# Altium schematic sheet PowerStage.SchDoc: Controlador PID
size A4; Organization: Altium Limited; Address1: L3, 12a Rodborough Rd; Address2: Frenchs Forest; Address3: NSW; Address4: Australia 2086; Revision: R01; sheetnumberh: 3; sheettotall: 5; Alumno: Irumberry Juan - Matwiejczuk Leandro; Curso: 512; Materia: Técnicas Digitales III; Docentes: Ing. Marín Ariel; SheetNumber: 3; SheetTotal: 5
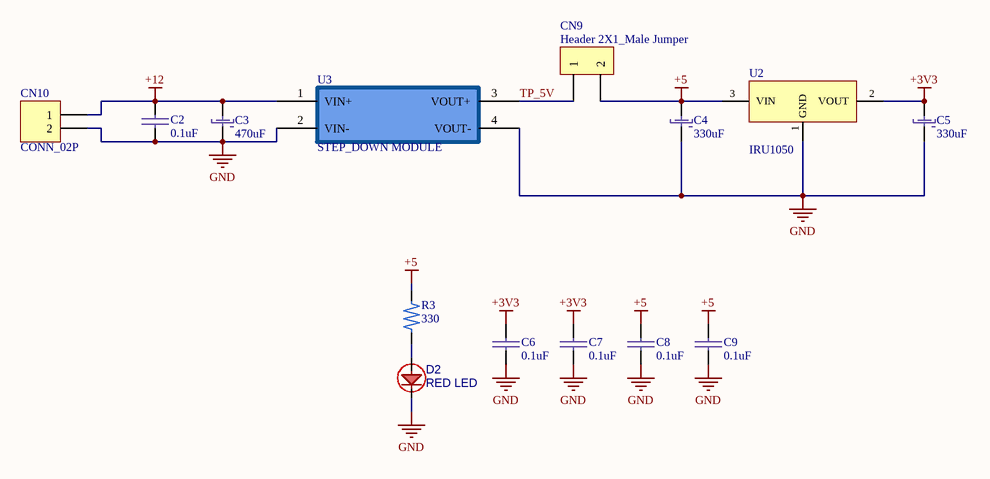
[diagram p0: PowerStage.SchDoc]

## Parts
C2  0.1uF  [CAP_Axial_0.2mm]
C3  470uF  [C_RAD_11MM]
C4  330uF  [C_RAD_5mm]
C5  330uF  [C_RAD_5mm]
C6  0.1uF  [CAP_Axial_0.2mm]
C7  0.1uF  [CAP_Axial_0.2mm]
C8  0.1uF  [CAP_Axial_0.2mm]
C9  0.1uF  [CAP_Axial_0.2mm]
CN9  Header 2X1_Male Jumper  [JUMPER 2x1 PIN]
CN10  CONN_02P  [TERMINAL_BLOCK_2_PIN]
D2  RED LED  [LED_DIODE_3.9mm]
R3  330  [RES_AXIAL_3.2_6MM]
U2  IRU1050  [IRU1050]
U3  STEP_DOWN MODULE  [STEP_DOWN_MODULE]

## Nets
+3V3: C5.1 C6.1 C7.1 U2.2(VOUT)
+5: C4.1 C8.1 C9.1 CN9.2 R3.2 U2.3(VIN)
+12: C2.1 C3.1 CN10.1 U3.1(VIN+)
GND: C2.2 C3.2 C4.2 C5.2 C6.2 C7.2 C8.2 C9.2 CN10.2 D2.K U2.1(GND) U3.2(VIN-) U3.4(VOUT-)
TP_5V: CN9.1 U3.3(VOUT+)
NetD2_A: D2.A R3.1

## Notes on the sheet
- Title:
- Revision:
- Alumnos:
- Materia:
- Docente:
- Curso:
- File:
- Date:
- Sheet
- of

## Library data of the parts
C2 C6-C9 = CAP_NP: Non-Polarized Capacitor
C3-C5 = Cap_Pol: Polarized Capacitor
CN9 = Jumper 2 Pin: Header, 2-Pin, Single row,male; LatestRevisionDate: 17-Jul-2002; LatestRevisionNote: Re-released for DXP Platform.; Publisher: Altium Limited
CN10 = CONN_02P: Connector Generic 2 Vias
D2 = LED
R3 = RES: Through-hole Resistor
U2 = IRU1050-33: 5A  FIXED 3V3 LOW DROPOUT POSITIVE ADJUSTABLE REGULATOR
U3 = STEP_DOWN_MODULE